# EasyEDA Pro project farmHot.eprj

# Schematic Schematic1
Board Name: Board1; Create Date: 2025-05-21; Page Name: P1; Project Name: farmHot; Schematic Name: Schematic1; Update Date: 2025-05-24; Company: EasyEDA.com; Page Size: A4; Version: V1.0
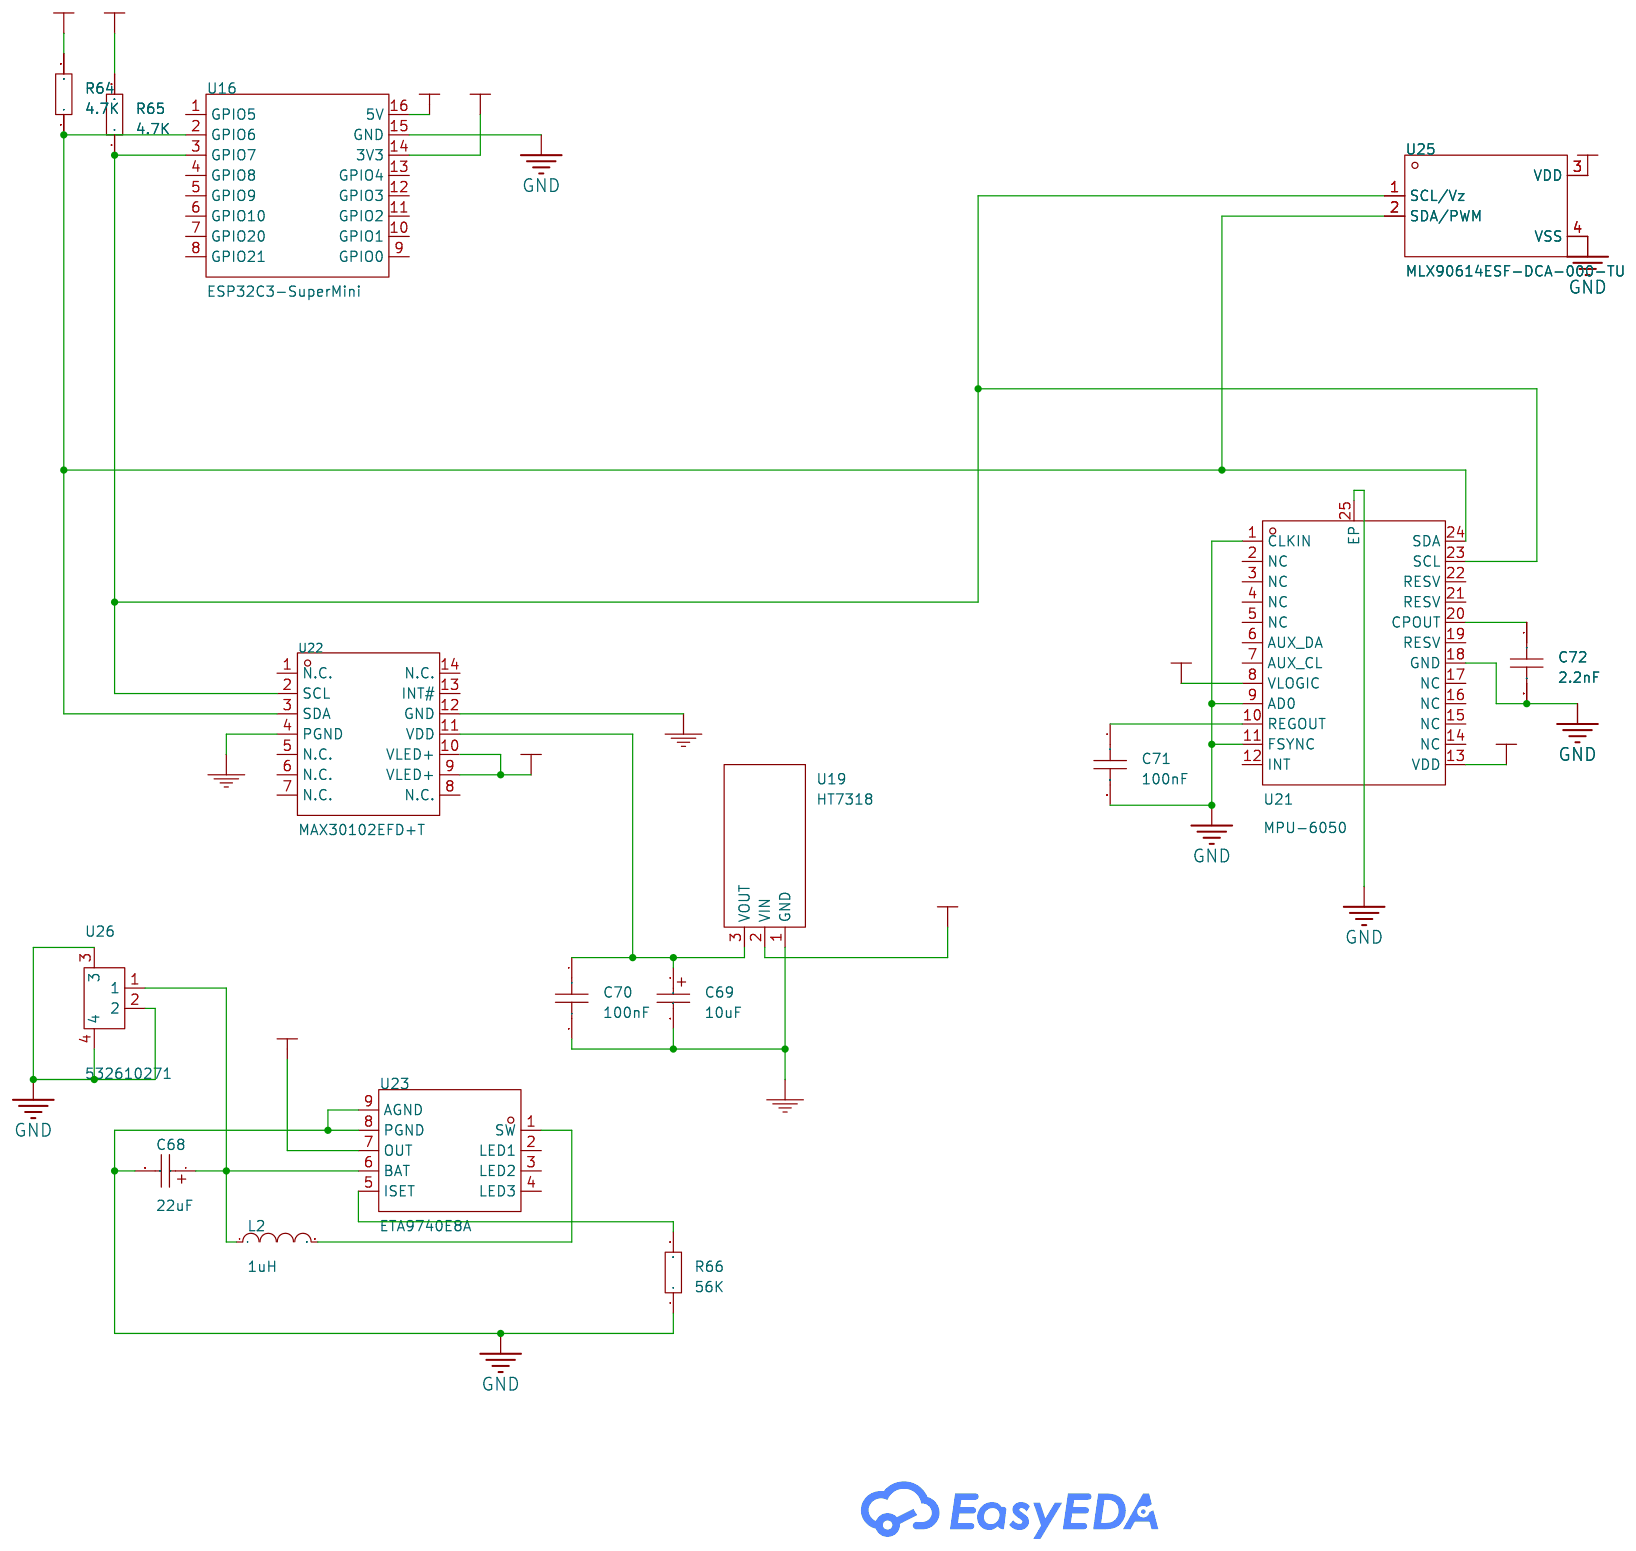
[diagram p0: schematic sheet]

## Parts
C68  22uF  [CAP-SMD_BD3.0-L3.3-W3.3-RD]
C69  10uF  [CAP-SMD_BD3.0-L3.3-W3.3-RD]
C70  100nF  [C0201]
C71  100nF  [C0201]
C72  2.2nF  [C0201]
L2  1uH  [L0402]
R64  4.7K  [R0603]
R65  4.7K  [R0603]
R66  56K  [R0603]
U16  ESP32C3-SuperMini  [COMM-SMD_16P-L22.5-W18.0-P2.54-TL]
U19  HT7318  [SOT-89-3_L4.5-W2.5-P1.50-LS4.2-BR]
U21  MPU-6050  [QFN-24_L4.0-W4.0-P0.50-BL-EP2.7]
U22  MAX30102EFD+T  [OESIP-14_L5.6-W3.3-P0.80-TL]
U23  ETA9740E8A  [ESOP-8_L4.9-W3.9-P1.27-LS6.0-BL-EP-1]
U25  MLX90614ESF-DCA-000-TU  [TO-39-4_MELEXIS_MLX90614XXA]
U26  532610271  [CONN-SMD_532610271]

## Library data of the parts
C68 C69 = C_Ele_SMD_3x5.4mm: Supplier Footprint: SMD,3x5.4mm
C70-C72 = CAP_0201: Supplier Footprint: 0201
L2 = L_0402
R64-R66 = Res_0603: Supplier Footprint: 0603
U16 = ESP32C3-SuperMini: Supplier Part: C9900147397; Supplier Footprint: SMD-16P; JLCPCB Part Class: Extended Part; Supplier: LCSC
U19 = HT7318_C259237: LCSC Part Name: 输入12V 输出1.8V 150mA; Supplier Part: C259237; Manufacturer: HOLTEK(合泰/盛群); Supplier Footprint: SOT-89-3; JLCPCB Part Class: Extended Part; Datasheet: https://atta.szlcsc.com/upload/public/pdf/source/20240403/B940B90F51FA39A5522B6E5C60F9C76D.pdf; Supplier: LCSC; Output Type: Fixed; Voltage - Supply: 12V; Output Voltage: 1.8V; Output Current: 150mA; Voltage Dropout: 170mV@(40mA); Output Configuration: Positive electrode; Number of Outputs: 1
U21 = MPU-6050: Supplier Part: C24112; Manufacturer: TDK InvenSense(应美盛); Supplier Footprint: QFN-24-EP(4x4); JLCPCB Part Class: Extended Part; Datasheet: https://atta.szlcsc.com/upload/public/pdf/source/20140425/1457707046159.pdf; Supplier: LCSC; Sensor Type: 加速度计陀螺仪; Operating Temperature: -40℃~+85℃
U22 = MAX30102EFD+T_C6454833: Supplier Part: C6454833; Manufacturer: ADI(亚德诺)/MAXIM(美信); Supplier Footprint: OESIP-14; JLCPCB Part Class: Extended Part; Datasheet: https://atta.szlcsc.com/upload/public/pdf/source/20230523/5357A0E2EBB238F1082B332F3131EA1A.pdf; Supplier: LCSC; Operating Temperature: -40℃~+85℃
U23 = ETA9740E8A: Supplier Part: C7465512; Manufacturer: ETA(钰泰); Supplier Footprint: ESOP8; JLCPCB Part Class: Extended Part; Datasheet: https://atta.szlcsc.com/upload/public/pdf/source/20230717/431179BC63C0A80883F19948963E29F3.pdf; Supplier: LCSC; Voltage - Supply: 4.5V~5.5V; Charging Saturation Voltage: 4.21V; End-Off Voltage: 3.2V; Type of Battery: Lithium-ion; Number of Cells: 1; Operating Temperature: -40℃~+85℃
U25 = MLX90614ESF-DCA-000-TU: Supplier Part: C17266420; Manufacturer: Melexis(比利时迈来芯); Supplier Footprint: TO-39; JLCPCB Part Class: Extended Part; Datasheet: https://atta.szlcsc.com/upload/public/pdf/source/231023/C17192539-0c521c61c9b67c34f193697436f9a827.pdf; Supplier: LCSC; Voltage - Supply: 2.6V~3.6V
U26 = 532610271_C177225: LCSC Part Name: 1x2P 间距:1.25mm 卧贴 系列:PicoBlade(MX 1.25); Supplier Part: C177225; Manufacturer: MOLEX; Supplier Footprint: SMD,P=1.25mm; JLCPCB Part Class: Extended Part; Supplier: LCSC; Pins Structure: 1x2P; Pitch: 1.25mm; Mounting Style: Horizontal attachment; Reference Series: PicoBlade(MX 1.25); Number of Pins: 2P; Number of Rows: 1; Number of PINs Per Row: 2; Current Rating (Max): 1A; Contact Material: Phosphor Bronze; Contact Plating: Tin; Operating Temperature Range: -40℃~+105℃; Rated Voltage (Max): 125V; Plastic Material: 玻纤增强PA; Flame Retardant Rating: UL94V-0; Supplementary Features: Auxiliary soldering legs; Colour: White; Z-Height of the Board: 3.4mm; X-Length of Bottom Edge on Board (Spacing Line): 7.65mm; Y-Width of Bottom Edge on Board: 5.2mm

## Nets
1.8V: C69.1 C70.1 U19.3(VOUT) U22.11(VDD)
3V3: R64.2 R65.2 U16.14(3V3) U19.2(VIN) U21.8(VLOGIC) U21.13(VDD) U22.9(VLED+) U22.10(VLED+) U25.3(VDD)
5V: U16.16(5V) U23.7(OUT)
GND: C68.2 C69.2 C70.2 C71.2 C72.2 R66.1 U16.15(GND) U19.1(GND) U21.1(CLKIN) U21.9(AD0) U21.11(FSYNC) U21.18(GND) U21.25(EP) U22.4(PGND) U22.12(GND) U23.8(PGND) U23.9(AGND) U25.4(VSS) U26.2 U26.3 U26.4
$1N754: R65.1 U16.3(GPIO7) U21.23(SCL) U22.2(SCL) U25.1(SCL/Vz)
$1N755: R64.1 U16.2(GPIO6) U21.24(SDA) U22.3(SDA) U25.2(SDA/PWM)
$1N7337: C68.1 L2.1 U23.6(BAT) U26.1
$1N11704: R66.2 U23.5(ISET)
$1N11786: L2.2 U23.1(SW)
$1N12199: C71.1 U21.10(REGOUT)
$1N12305: C72.1 U21.20(CPOUT)

Not connected (* = marked no-connect by the designer): U16 1(GPIO5) 4(GPIO8) 5(GPIO9) 6(GPIO10) 7(GPIO20) 8(GPIO21) 9(GPIO0) 10(GPIO1) 11(GPIO2) 12(GPIO3) 13(GPIO4); U21 2(NC) 3(NC) 4(NC) 5(NC) 6(AUX_DA) 7(AUX_CL) 12(INT) 14(NC) 15(NC) 16(NC) 17(NC) 19(RESV) 21(RESV) 22(RESV); U22 1(N.C.) 5(N.C.) 6(N.C.) 7(N.C.) 8(N.C.) 13(INT#) 14(N.C.); U23 2(LED1) 3(LED2) 4(LED3)

# Schematic Lipo Rider Plus
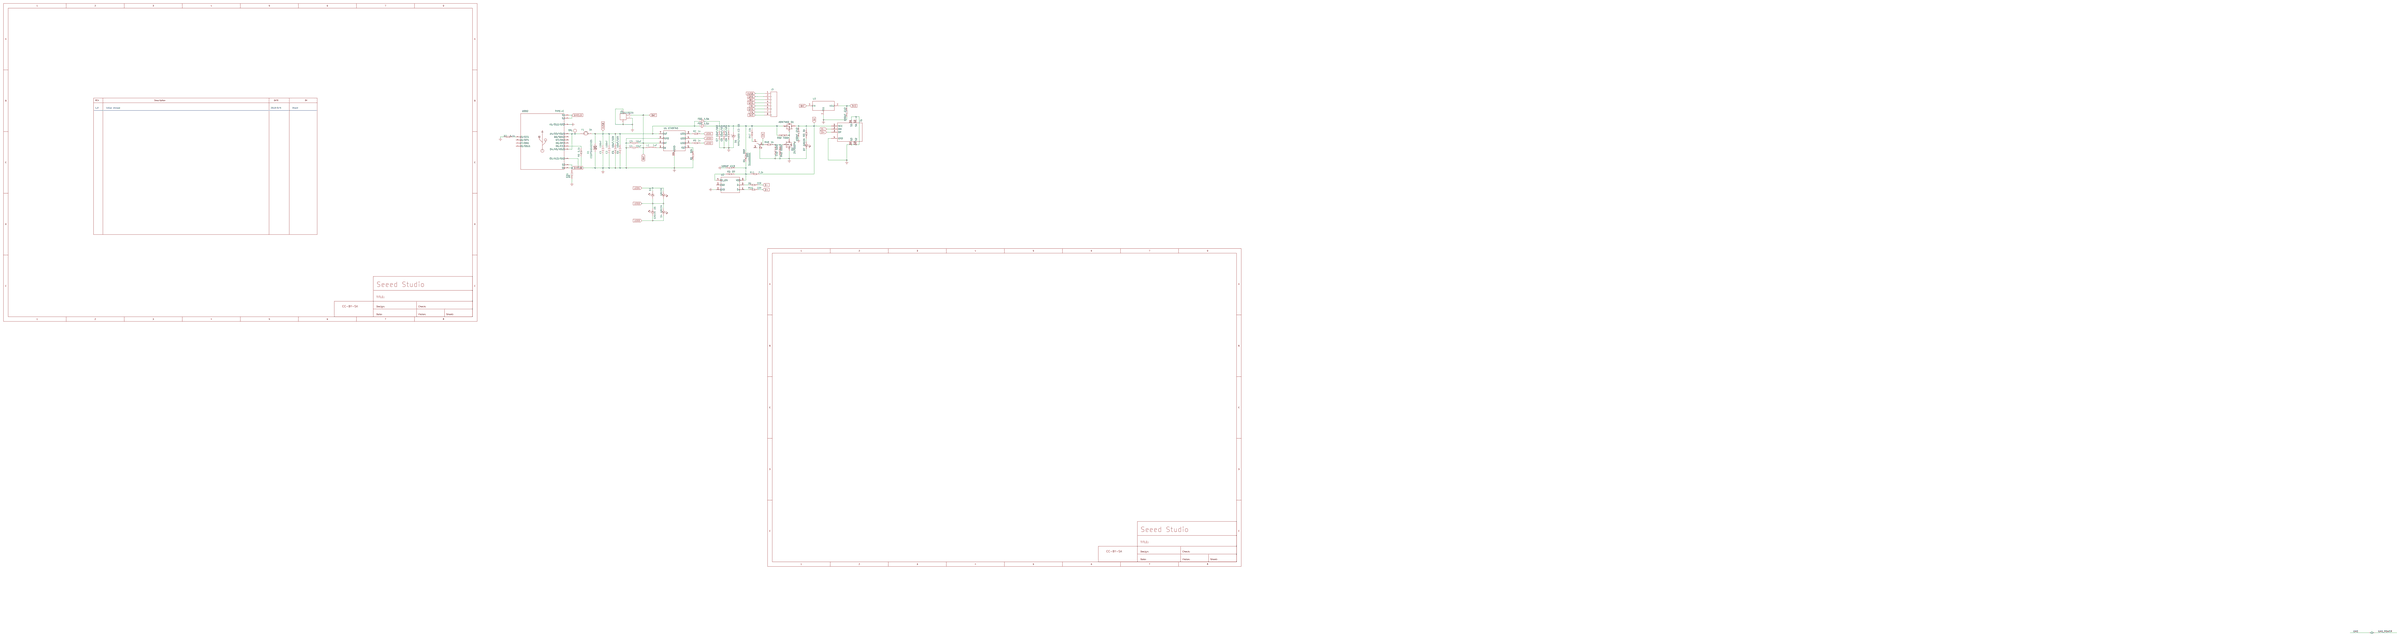
[diagram p1: schematic sheet]

## Parts
C1  100nF
C2  100nF
C3  10uF
C4  10uF
C5  10uF/10V
C6  10uF/10V
C7  10uF/10V
C8  10uF/10V
C9  10uF/10V
C11  0R
C12  100nF
C13  100nF
C42  10nF
C43  100nF
D1  ESDPSA0402V05
D2  GREEN
D3  GREEN
D4  GREEN
D5  GREEN
D6  MMSZ4689-E3-08
D7  GREEN
F1  3A
FB1  1.5A
FB2  1.5A
FR1  SEEEDSTUDIO-OPEN-SCH-FRAME-BIG
FR2  SEEEDSTUDIO-OPEN-SCH-FRAME-BIG
J2  USB4+4P-SMD+DIP
J3  HEADER-8P-65/35MIL
J4  320110026
L1  1uF
Q1  AON7403
Q2  2N7002PW
R1  56k
R2  1k
R3  1k
R4  DNP
R5  0R
R6  22R
R7  5.1k
R8  5.1k
R9  1k
R10  22R
R11  2.2k
R32  100k
R46  100k
R47  10k
R48  1k
SW1  311030001
TP1  TEST
U1  ETA9740
U2  CONTROLLER-FP6601Q
U3  PMIC-XC6206PMR
U$3  SEEDSTUDIO-SCH-MODLIST
USB2  TYPE-C

## Library data of the parts
C1 C2 C11-C13 C42 C43 = Discrete-new_CAP_-0402
C3 C4 = Discrete-new_CAP_-0603
C5-C9 = Discrete-new_CAP_-0805
D1 = Discrete-new_D-ESD-2P-DOUBLE_-0402
D2-D5 D7 = Discrete-new_LED_-0402
D6 = Discrete-new_D-ZENER-2P_-304030008
F1 = Discrete-new_FUSE_'1812'
FB1 FB2 = Discrete-new_FERRITE-BEAD_-0805
FR1 FR2 = moudle-new_SEEEDSTUDIO-OPEN-SCH-FRAME-BIG_: DRAWING_NAME: Lipo Rider Plus; SHEET: 1/1
J2 = Connector-new_USB4+4P_-SMD+DIP
J3 = Connector-new_HEADER-8P_-65/35MIL
J4 = Connector-new_JST-2P-SMD_'2.0'
L1 = Discrete-new_INDUCTOR_-4430
Q1 = Discrete-new_MOSFET-P_-AON7403
Q2 = Discrete-new_MOSFET-N_'SI1304BDL'
R1-R11 R32 R46-R48 = Discrete-new_RES_-0402
SW1 = Discrete-new_SWITCH-3+4P_-311030001
TP1 = Discrete-new_TEST-POINT_'4545'
U1 = IC-new_PMIC-ETA9740_
U2 = IC-new_CONTROLLER-FP6601Q_
U3 = IC-new_PMIC-XC6206P_MR
U$3 = moudle-new_SEEDSTUDIO-SCH-MODLIST_
USB2 = Connector-new_USB2.0-TYPE-C_

## Nets
3V3: C12.1 J3.8 U3.2(VOUT)
5V: C43.1 J2.1(VCC) J3.5 Q1.5*5(D) R3.2 R11.2
GND_POWER: C1.2 C2.2 C3.2 C4.2 C5.1 C6.1 C7.1 C8.1 C9.1 C11.2 C12.2 C13.2 C42.2 C43.2 D1.1 D6.+ D7.- J2.4(GND) J2.S1(S0) J2.S2(S1) J2.S3(S2) J2.S4(S3) J3.2 J3.4 J3.6 J4.3 J4.4 J4.-(2) Q2.2(S) R1.1 R7.1 R8.2 R46.1 SW1.SS1*4(SS2) U1.8(PGND) U1.PAD(AGND) U2.2(GND) U3.1(VSS) USB2.A1_B12(A1/B12/GND) USB2.B1_A12(B1/A12/GND)
VCC_5V: C7.2 C8.2 C9.2 D6.- FB1.2 FB2.2 Q1.1*3(S) R4.2 R32.1 R47.2
BAT: C3.1 C4.1 J3.3 J4.+(1) L1.1 U1.6(BAT) U3.3(VIN)
D+: J2.3(DP) R10.2
D-: J2.2(DM) R6.2
EN: J3.7 R48.1 SW1.2(COM)
LED1: D2.+ D3.- R2.2
LED2: D4.- D5.+ R9.2
LED3: D2.- D3.+ D4.+ D5.- U1.4(LED3)
N$1: R7.2 USB2.A5(A5/CC1)
N$2: R8.1 USB2.B5(B5/CC2)
N$3: R47.1 SW1.1(A)
N$4: F1.1 TP1.T USB2.A4_B9(A4/B9/VBUS) USB2.B4_A9(B4/A9/VBUS)
N$6: D7.+ R3.1
N$7: R1.2 U1.5(ISET)
N$8: L1.2 U1.1(SW)
N$9: R9.1 U1.3(LED2)
N$10: R5.1 U2.4(QC_EN)
N$11: C13.1 R4.1 R5.2 R11.1 U2.5(VDD)
N$12: R2.1 U1.2(LED1)
N$13: R6.1 U2.6(D-)
N$14: R10.1 U2.1(D+)
N$49: Q1.4(G) Q2.3(D) R32.2
N$52: C42.1 Q2.1(G) R46.2 R48.2
SHIELD: C11.1 USB2.S1*2(S1) USB2.S2*2(S2) USB2.S3 USB2.S4
VUSB: C1.1 C2.1 C5.2 C6.2 D1.2 F1.2 FB1.1 FB2.1 J3.1 U1.7(OUT)

Not connected (* = marked no-connect by the designer): SW1 3(B); U2 3(FBO); USB2 A6(A6/DP1) A7(A7/DN1) A8(A8/SBU1) B6(B6/DP2) B7(B7/DN2) B8(B8/SBU2)

## Notes on the sheet
- 1.0
- initial release
- 2019/9/6
- Bruce

# Schematic Adafruit MPU6050
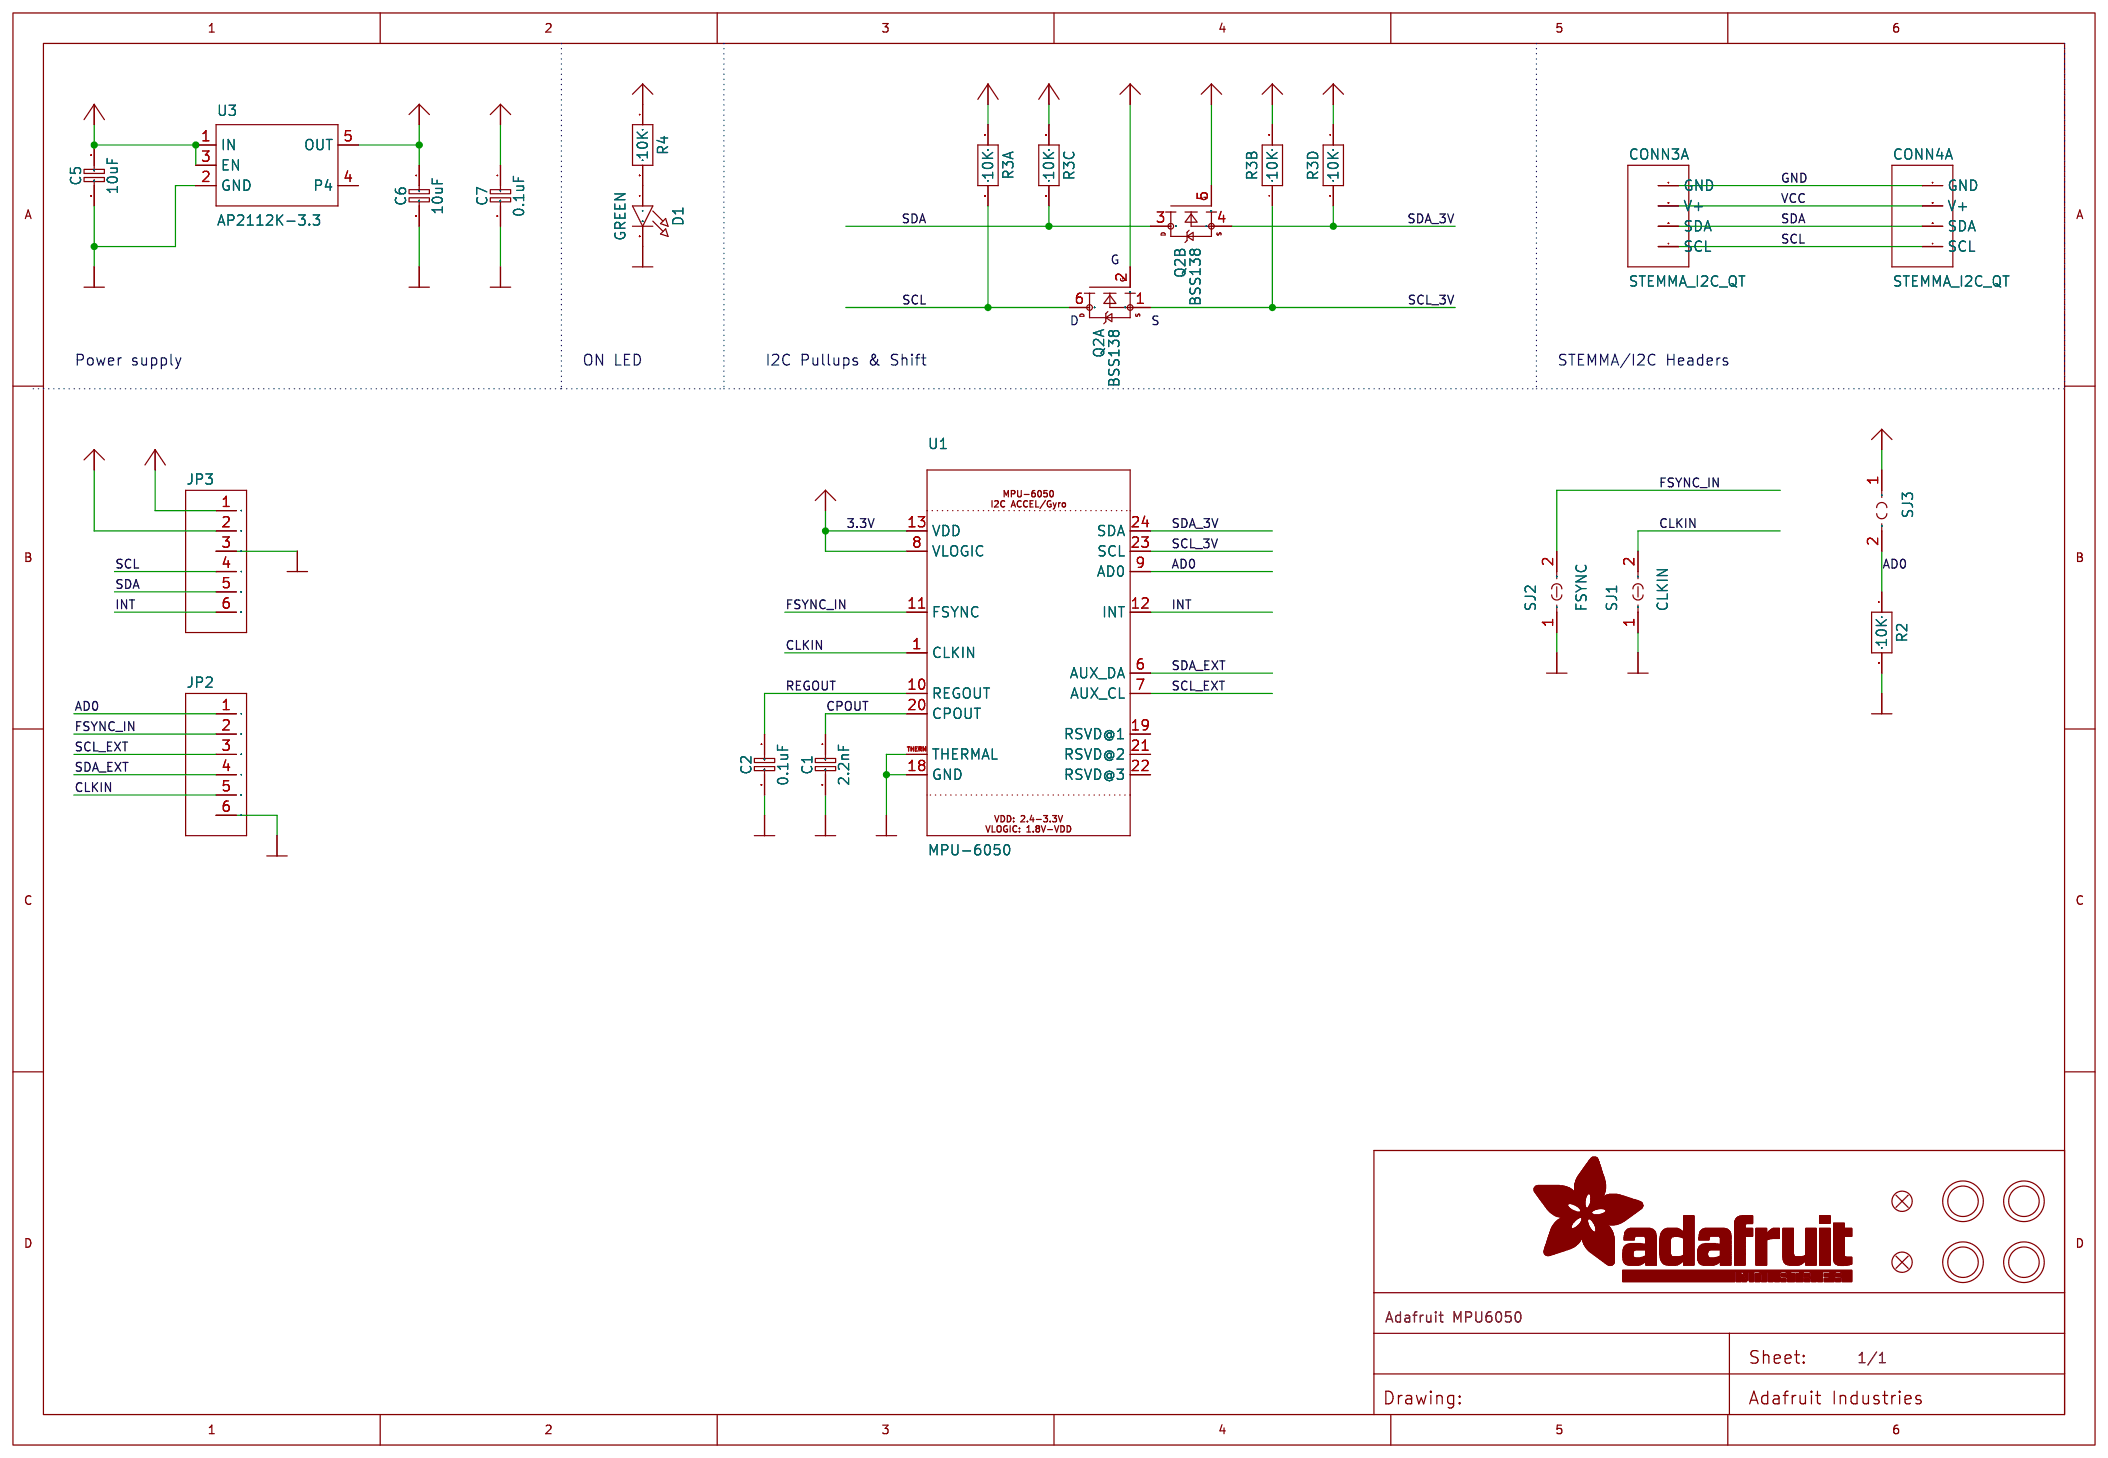
[diagram p2: schematic sheet]

## Parts
C1  2.2nF
C2  0.1uF
C5  10uF
C6  10uF
C7  0.1uF
CONN3  STEMMA_I2C_QT  (section G$1)
CONN4  STEMMA_I2C_QT  (section G$1)
D1  GREEN
FID3  FIDUCIAL_1MM
FID4  FIDUCIAL_1MM
JP2  HEADER-1X6ROUND
JP3  HEADER-1X670MIL
Q2  BSS138  (sections G$1,G$2)
R2  10K
R3  10K  (sections G$1,G$2,G$3,G$4)
R4  10K
SJ1  CLKIN
SJ2  FSYNC
SJ3  SOLDERJUMPER
U1  MPU-6050
U3  AP2112K-3.3
U$39  MOUNTINGHOLE2.5
U$40  MOUNTINGHOLE2.5
U$41  FRAME_A4_ADAFRUIT
U$42  MOUNTINGHOLE2.5
U$43  MOUNTINGHOLE2.5

## Library data of the parts
C1 C2 C7 = microbuilder_CAP_CERAMIC_0603_NO
C5 C6 = microbuilder_CAP_CERAMIC_0805-NOOUTLINE
CONN3 CONN4 = microbuilder_STEMMA_I2C__QT
D1 = microbuilder_LED_0603_NOOUTLINE
FID3 FID4 = microbuilder_FIDUCIAL__1MM
JP2 = microbuilder_HEADER-1X6_ROUND
JP3 = microbuilder_HEADER-1X6_70MIL
Q2 = microbuilder_MOSFET-N_DUAL_
R2 R4 = microbuilder_RESISTOR__0603_NOOUT
R3 = microbuilder_RESISTOR_4PACK_
SJ1 SJ2 = microbuilder_SOLDERJUMPER_CLOSED_
SJ3 = microbuilder_SOLDERJUMPER_
U1 = microbuilder_MPU-6050_
U3 = microbuilder_VREG_SOT23-5_
U$39 U$40 U$42 U$43 = microbuilder_MOUNTINGHOLE_2.5
U$41 = microbuilder_FRAME_A4_ADAFRUIT_: DRAWING_NAME: Adafruit MPU6050; SHEET: 1/1

## Nets
3.3V: C6.1 C7.1 JP3.2 Q2.2(G) Q2.5(G) R3.2(1) R3.4(1) R4.1 SJ3.1 U1.8(VLOGIC) U1.13(VDD) U3.5(OUT)
GND: C1.2 C2.2 C5.2 C6.2 C7.2 CONN3.1(GND) CONN4.1(GND) D1.C JP2.6 JP3.3 R2.2 SJ1.1 SJ2.1 U1.18(GND) U1.THERM(THERMAL) U3.2(GND)
VCC: C5.1 CONN3.2(V+) CONN4.2(V+) JP3.1 R3.1 R3.3(1) U3.1(IN) U3.3(EN)
AD0: JP2.1 R2.1 SJ3.2 U1.9(AD0)
CLKIN: JP2.5 SJ1.2 U1.1(CLKIN)
CPOUT: C1.1 U1.20(CPOUT)
FSYNC_IN: JP2.2 SJ2.2 U1.11(FSYNC)
INT: JP3.6 U1.12(INT)
N$1: D1.A R4.2
REGOUT: C2.1 U1.10(REGOUT)
SCL: CONN3.4(SCL) CONN4.4(SCL) JP3.4 Q2.6(D) R3.8(2)
SCL_3V: Q2.1(S) R3.7(2) U1.23(SCL)
SCL_EXT: JP2.3 U1.7(AUX_CL)
SDA: CONN3.3(SDA) CONN4.3(SDA) JP3.5 Q2.3(D) R3.6(2)
SDA_3V: Q2.4(S) R3.5(2) U1.24(SDA)
SDA_EXT: JP2.4 U1.6(AUX_DA)

Not connected (* = marked no-connect by the designer): U1 19(RSVD@1) 21(RSVD@2) 22(RSVD@3); U3 4(P4)

## Notes on the sheet
- G
- D
- S
- Power supply
- ON LED
- I2C Pullups & Shift
- STEMMA/I2C Headers

# Schematic GY-906 MLX90614
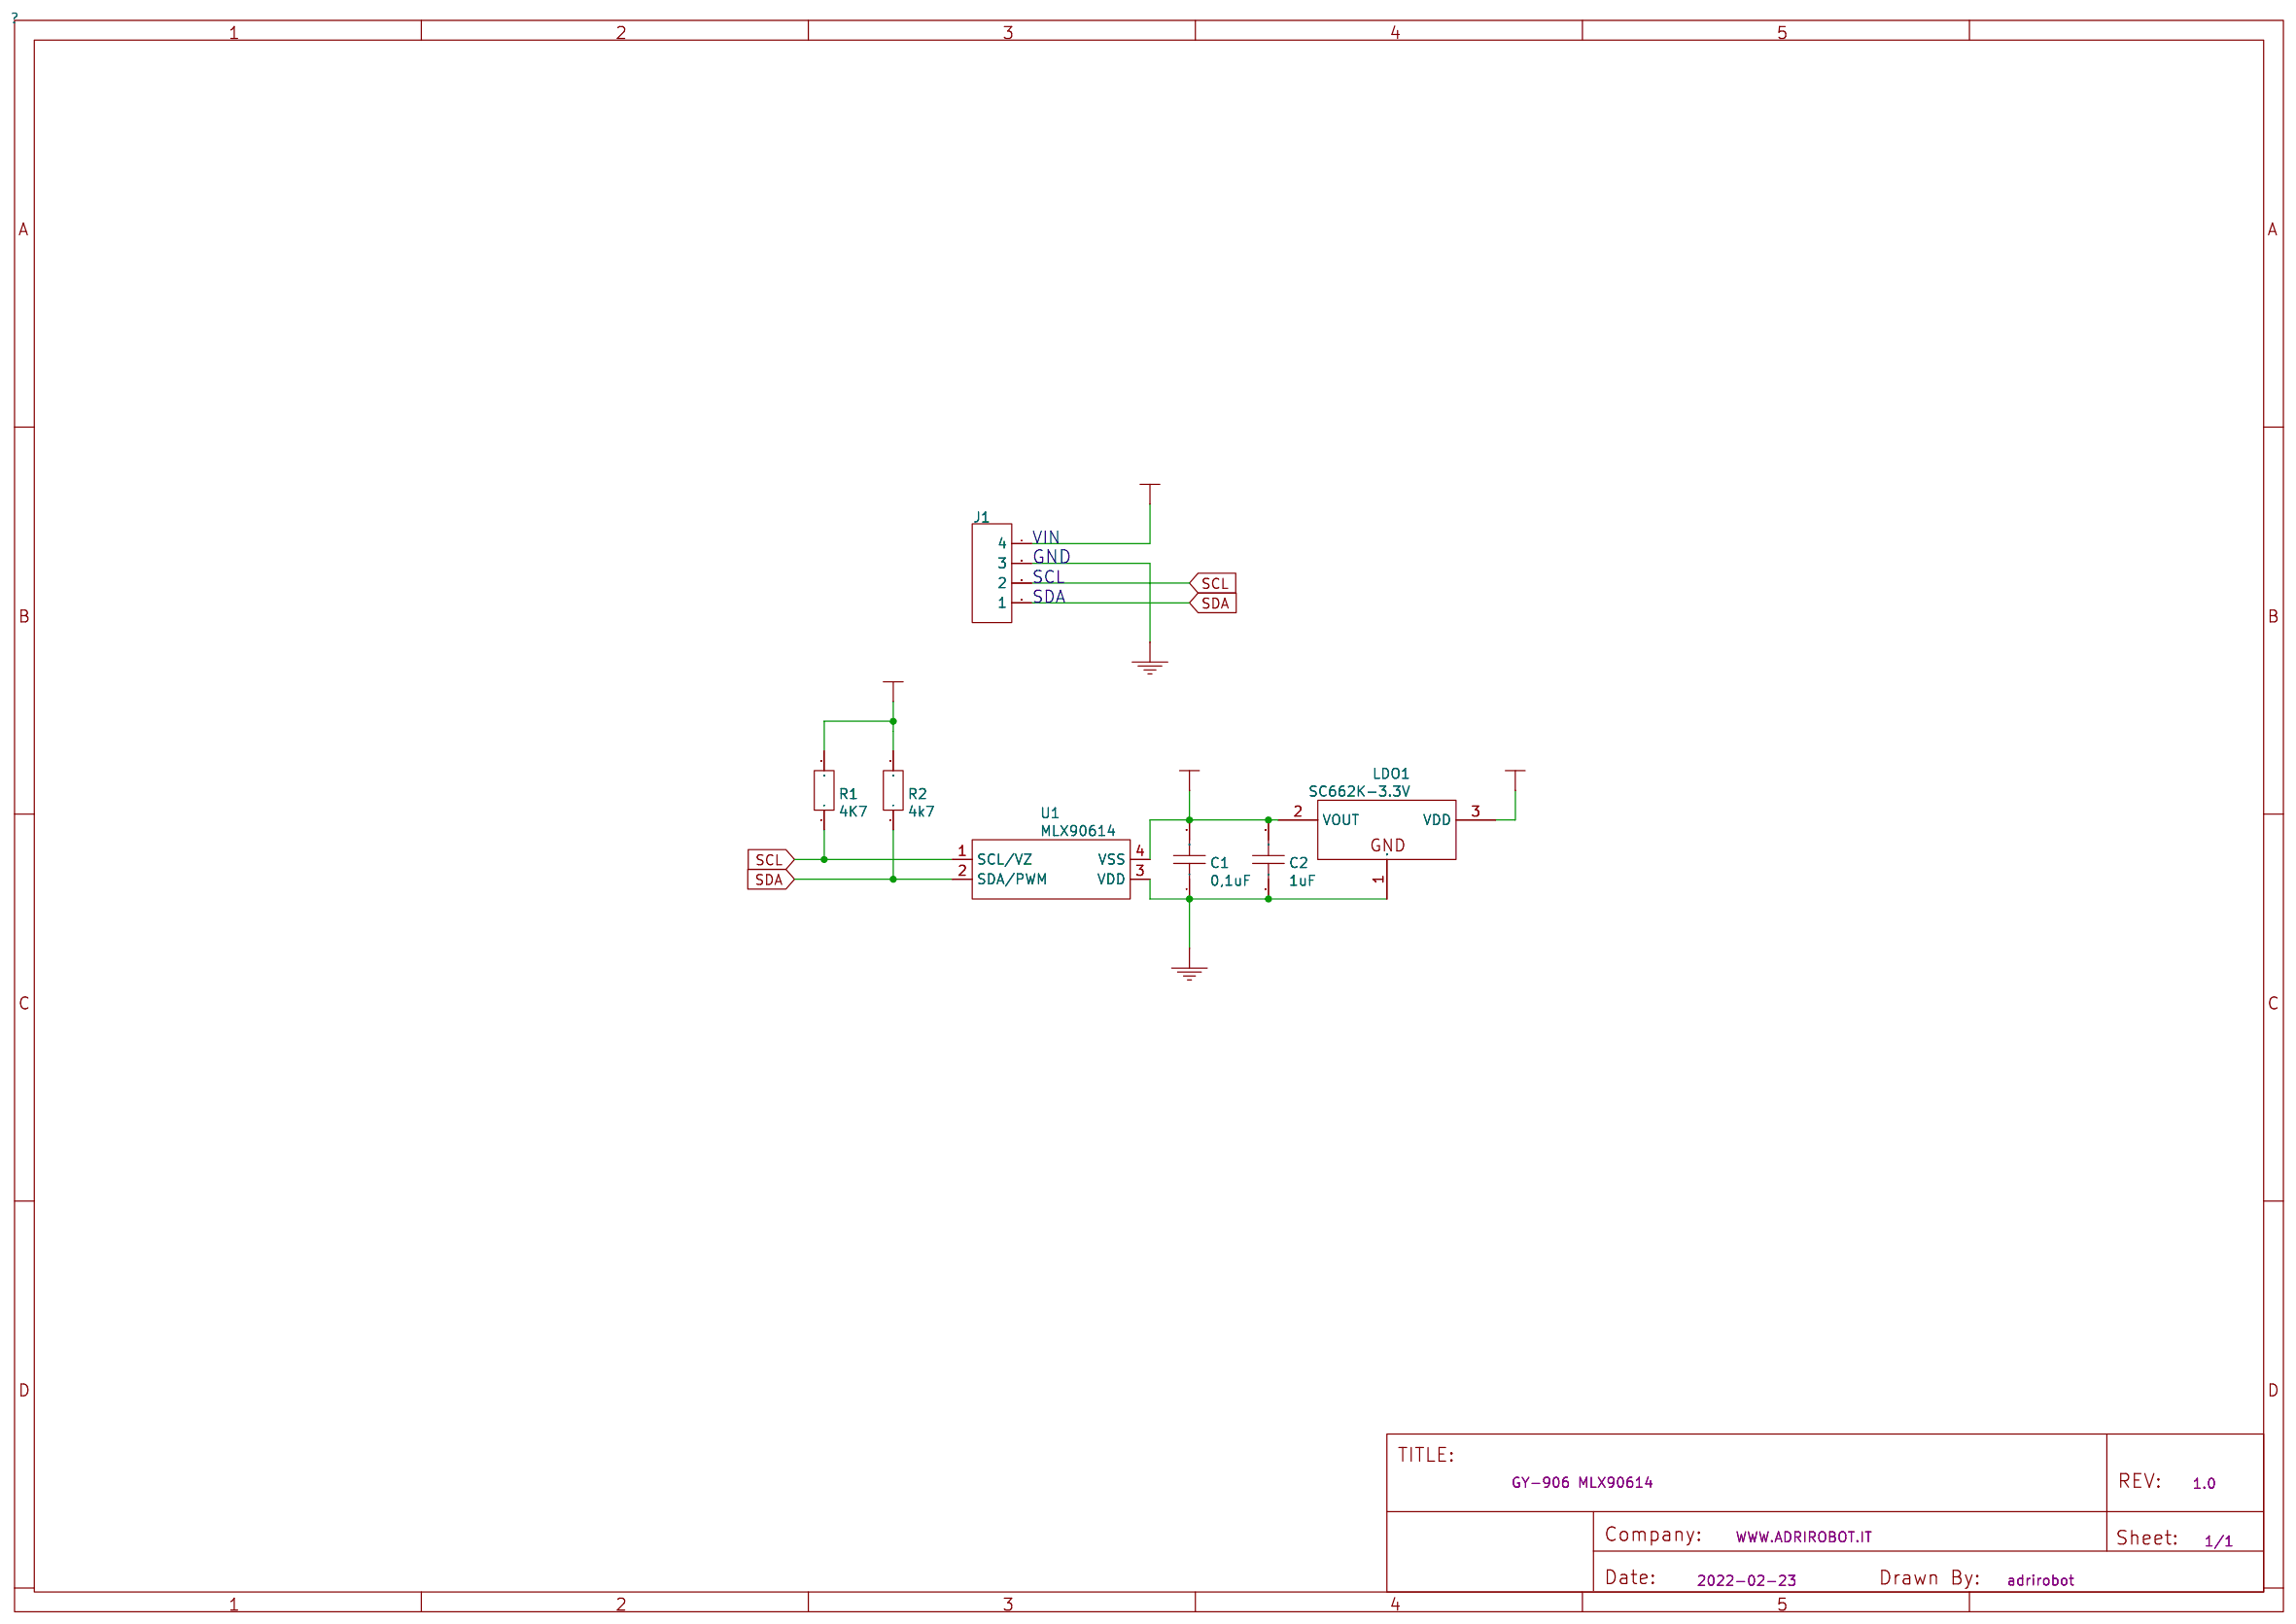
[diagram p3: schematic sheet]

## Parts
C1  0,1uF
C2  1uF
J1  HDR-M-2.54_1x4
LDO1  SC662K-3.3V
R1  4K7
R2  4k7
U1  MLX90614

## Library data of the parts
C1 = 0,1uF: nameAlias: Value(F); Contributor: LCEDA_Lib; spicePre: C; spiceSymbolName: C_0603_US
C2 = 1uF: nameAlias: Value(F); Contributor: LCEDA_Lib; spicePre: C; spiceSymbolName: C_0603_US
J1 = HDR-M-2.54_1x4: Supplier Part: C124378; Supplier: LCSC; Contributor: LCEDA_Lib; spicePre: J
LDO1 = SC662K-3.3V: Supplier: LCSC; Manufacturer: FM; Supplier Part: C83932; JLCPCB Part Class: Extended Part; spicePre: L
R1 = 4K7: nameAlias: Value(Ω); Contributor: LCEDA_Lib; spicePre: R; spiceSymbolName: R_0603_EU
R2 = 4k7: nameAlias: Value(Ω); Contributor: LCEDA_Lib; spicePre: R; spiceSymbolName: R_0603_EU
U1 = MLX90614: Supplier: LCSC; Supplier Part: C2837265; Manufacturer: null; JLCPCB Part Class: Extended Part; Contributor: LCSC; spicePre: U

## Nets
+3.3V: C1.2 C2.2 LDO1.2(VOUT) R1.2 R2.2 U1.4(VSS)
GND: C1.1 C2.1 J1.3 LDO1.1(GND) U1.3(VDD)
VIN: J1.4 LDO1.3(VDD)
SCL: J1.2 R1.1 U1.1(SCL/VZ)
SDA: J1.1 R2.1 U1.2(SDA/PWM)

## Notes on the sheet
- GND
- VIN
- SCL
- SDA

# Schematic SCH_max30102-schematic_2025-05-21
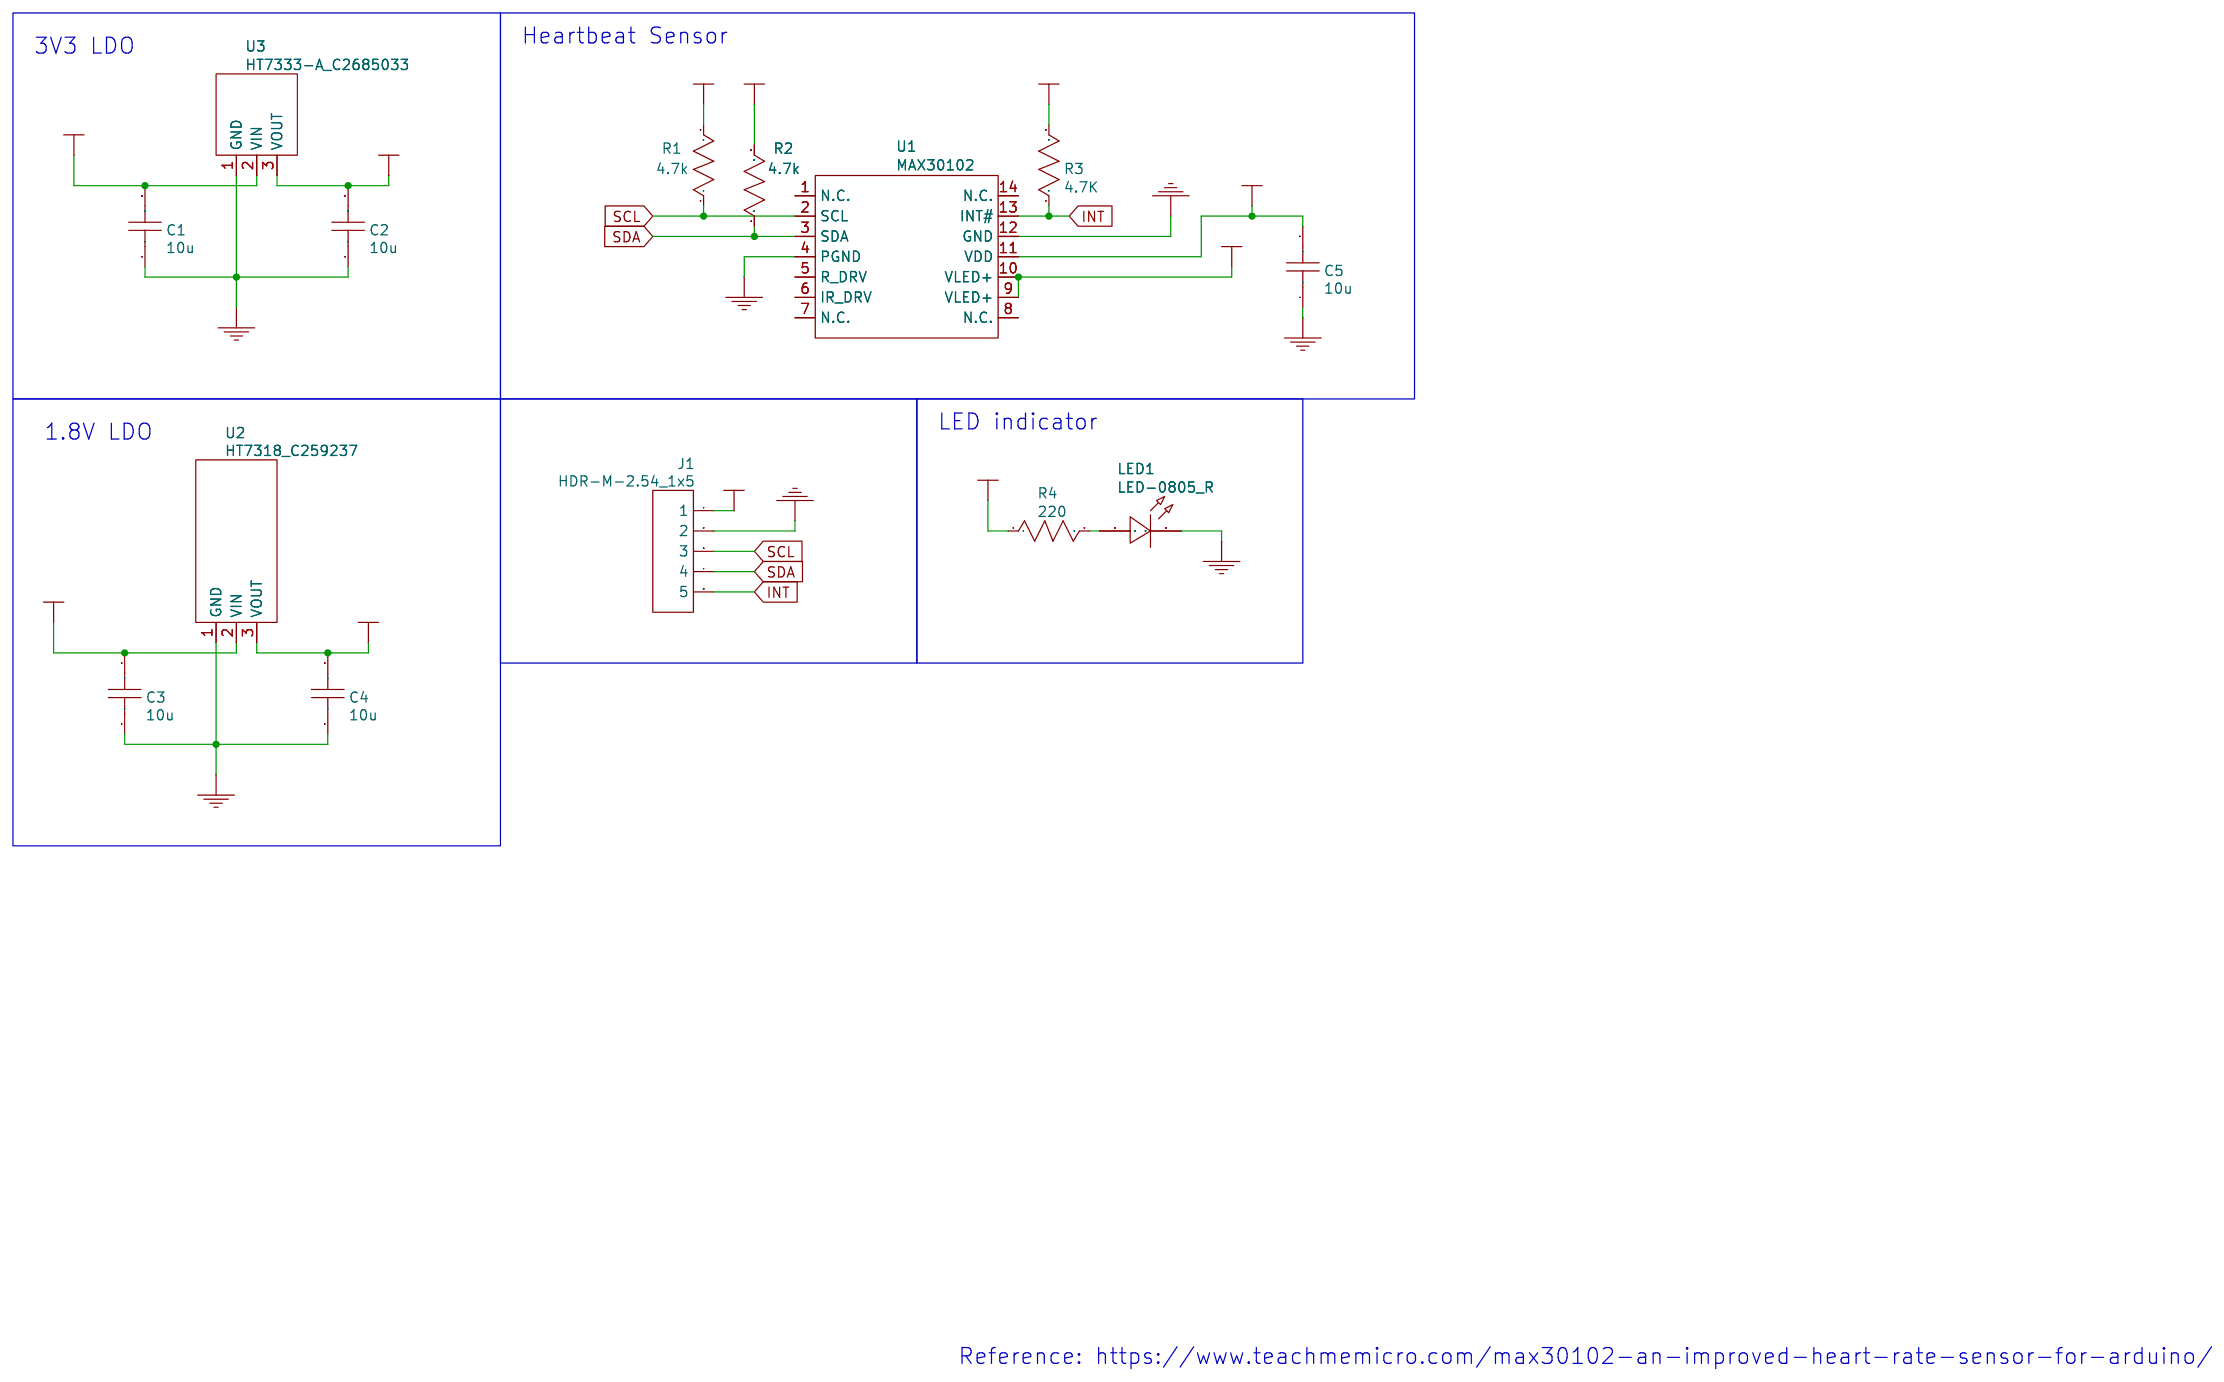
[diagram p4: schematic sheet]

## Parts
C1  10u
C2  10u
C3  10u
C4  10u
C5  10u
J1  HDR-M-2.54_1x5
LED1  LED-0805_R
R1  4.7k
R2  4.7k
R3  4.7K
R4  220
U1  MAX30102
U2  HT7318_C259237
U3  HT7333-A_C2685033

## Library data of the parts
C1-C5 = 10u: nameAlias: Value(F); Contributor: LCEDA_Lib; spicePre: C; spiceSymbolName: C_0402_US
J1 = HDR-M-2.54_1x5: Supplier Part: C358687; Supplier: LCSC; Contributor: LCEDA_Lib; spicePre: J
LED1 = LED-0805_R: Manufacturer: EVERLIGHT(台湾亿光); Manufacturer Part: 17-21SURC/S530-A3/TR8; Supplier Part: C72037; Contributor: LCEDA_Lib; spicePre: L
R1 R2 = 4.7k: nameAlias: Value(Ω); Contributor: LCEDA_Lib; spicePre: R; spiceSymbolName: R_0402_US
R3 = 4.7K: nameAlias: Value(Ω); Contributor: LCEDA_Lib; spicePre: R; spiceSymbolName: R_0402_US
R4 = 220: nameAlias: Value(Ω); Contributor: LCEDA_Lib; spicePre: R; spiceSymbolName: R_0402_US
U1 = MAX30102: Supplier: LCSC; Supplier Part: C2839431; Manufacturer: null; JLCPCB Part Class: Extended Part; Contributor: LCSC; spicePre: U
U2 = HT7318_C259237: Supplier: LCSC; Supplier Part: C259237; Manufacturer: Holtek Semicon; Manufacturer Part: HT7318; JLCPCB Part Class: Extended Part; Contributor: 立创EDA官方封装库; spicePre: U
U3 = HT7333-A_C2685033: Supplier: LCSC; Supplier Part: C2685033; Manufacturer: 国芯佳品; Manufacturer Part: HT7333-A; JLCPCB Part Class: Extended Part; Contributor: LCSC; spicePre: U

## Nets
1.8V: C4.2 C5.2 U1.11(VDD) U2.3(VOUT)
3V3: C2.2 R1.2 R2.2 R3.2 R4.1 U1.9(VLED+) U1.10(VLED+) U3.3(VOUT)
GND: C1.1 C2.1 C3.1 C4.1 C5.1 J1.2 LED1.2 U1.4(PGND) U1.12(GND) U2.1(GND) U3.1(GND)
VCC: C1.2 C3.2 J1.1 U2.2(VIN) U3.2(VIN)
INT: J1.5 R3.1 U1.13(INT#)
SCL: J1.3 R1.1 U1.2(SCL)
SDA: J1.4 R2.1 U1.3(SDA)
Net-(LED1-1): LED1.1 R4.2

Not connected (* = marked no-connect by the designer): U1 1(N.C.) 5(R_DRV) 6(IR_DRV) 7(N.C.) 8(N.C.) 14(N.C.)

## Notes on the sheet
- Heartbeat Sensor
- 3V3 LDO
- 1.8V LDO
- LED indicator
- Reference: https://www.teachmemicro.com/max30102-an-improved-heart-rate-sensor-for-arduino/

# Board PCB1
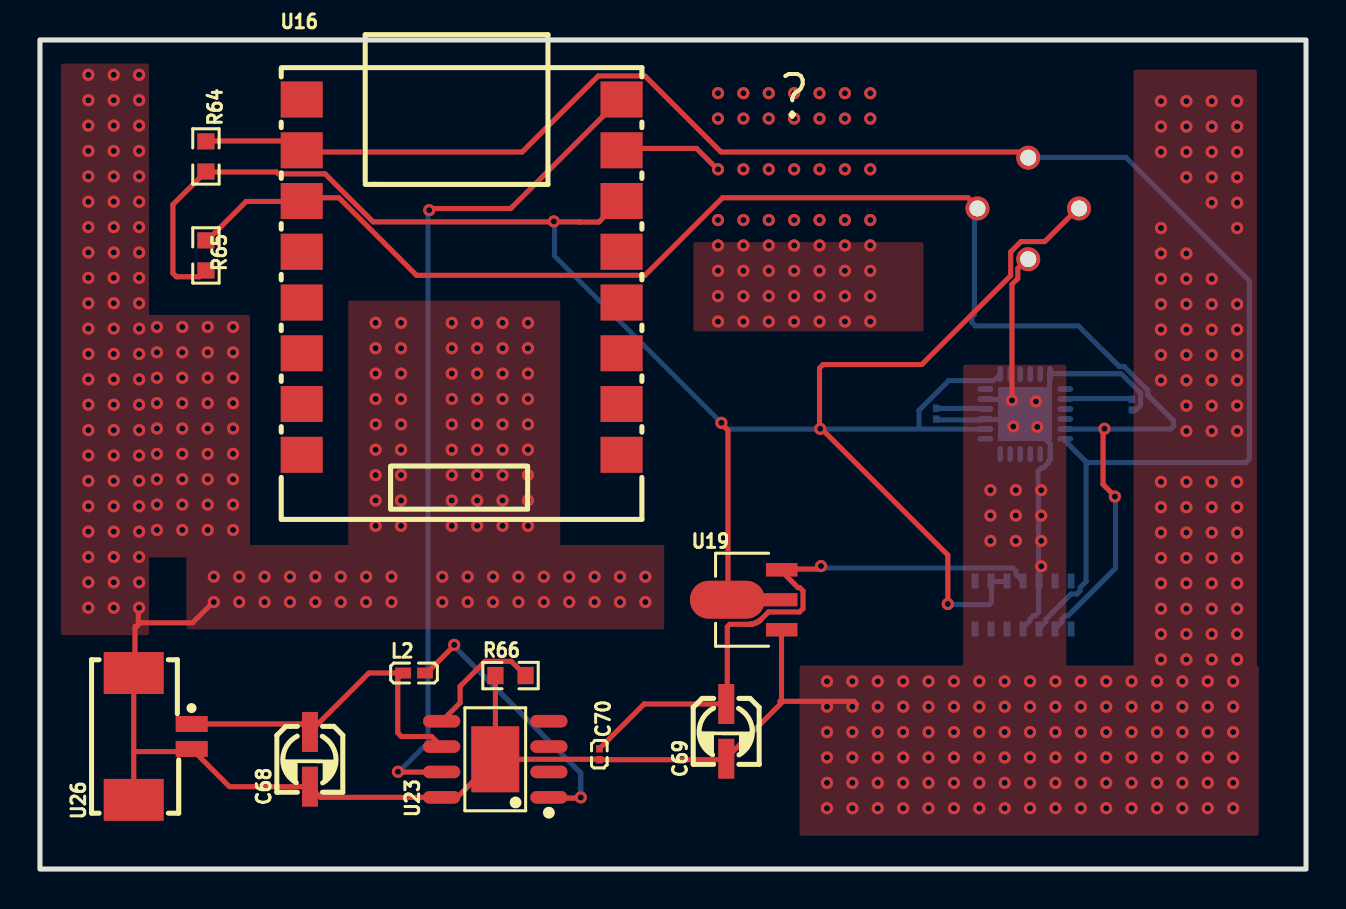
[diagram p5: board, top side]
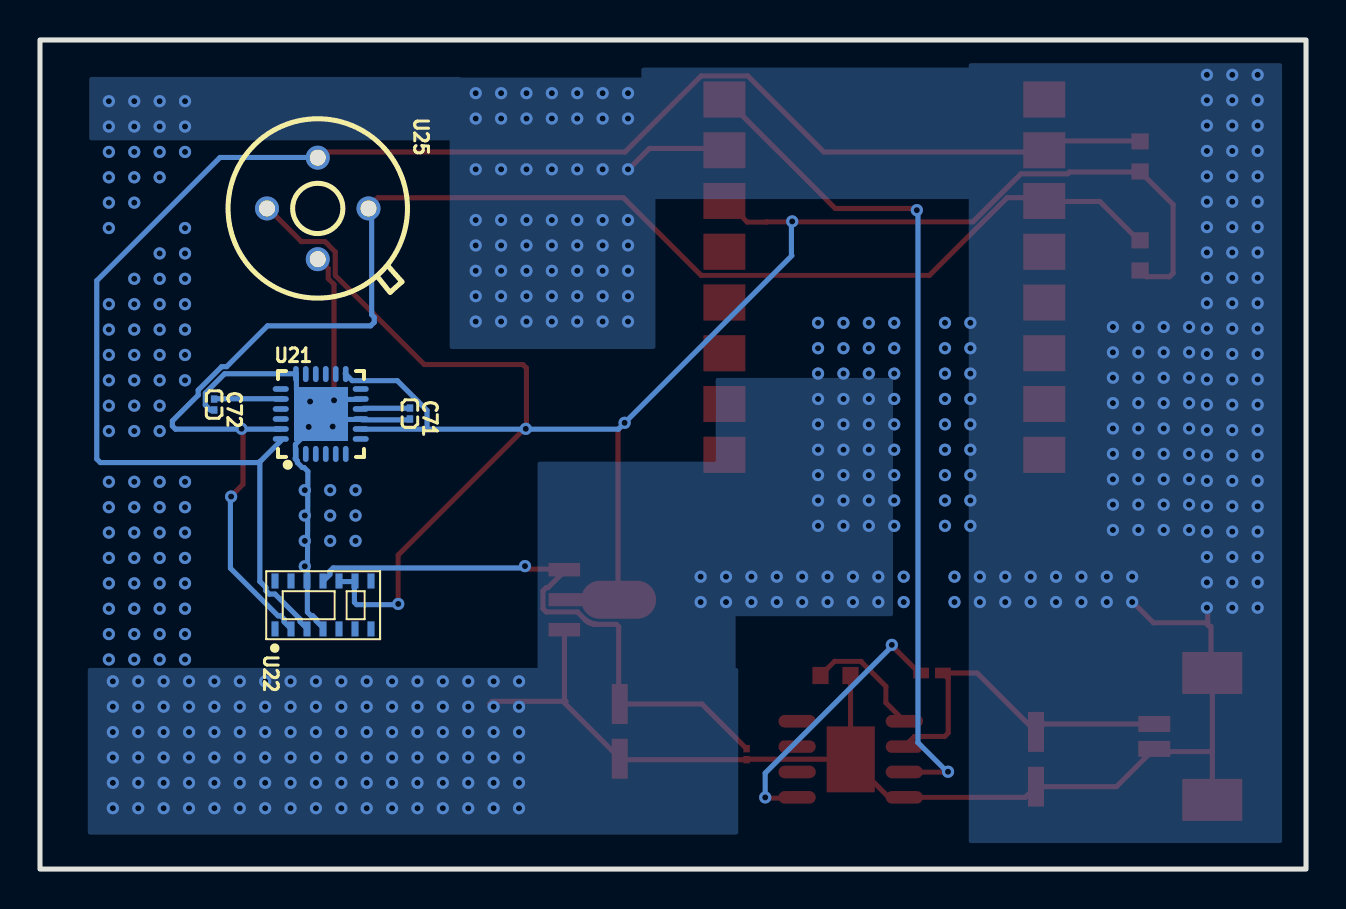
[diagram p6: board, bottom side, seen from below]

Outline 63.34 x 41.49 mm; copper layers: Top Layer, Bottom Layer. Coordinates in mm from the lower left corner of the outline.
Outline path: rectangle 0,41.49 63.34,0
Stack: Top Layer 0.035mm / Dielectric1 1.51mm FR4 er 4.5 / Bottom Layer 0.035mm

## Design rules (mm)
template: JLCPCB Capability(Two Layers Board)
spacing copperThickness1oz (default): track to track 0.102, other pairs 0.152 to 0.3
spacing copperThickness2oz: track to track 0.203, other pairs 0.152 to 0.3
track width copperThickness1oz (default): min 0.127, default 0.254, max 2.54
track width copperThickness2oz: min 0.203, default 0.254, max 2.54
differential pair differentialPair (default): width min 0.127, default 0.254, max 2.54; gap min 0.152, default 0.152
via viaSize (default): diameter min 0.5, default 0.61, max 10; hole min 0.3, default 0.305, max 6.3

## Placement (name value [footprint] x y rotation side)
C68  22uF  [CAP-SMD_BD3.0-L3.3-W3.3-RD]  13.51 5.49 90 top
C69  10uF  [CAP-SMD_BD3.0-L3.3-W3.3-RD]  34.34 6.89 90 top
C70  100nF  [C0201]  27.99 5.75 270 top
C71  100nF  [C0201]  44.83 22.8 270 bottom
C72  2.2nF  [C0201]  54.63 23.25 270 bottom
L2  1uH  [L0402]  18.71 9.81 0 top
R64  4.7K  [R0603]  8.3 35.66 270 top
R65  4.7K  [R0603]  8.3 30.71 270 top
R66  56K  [R0603]  23.54 9.68 0 top
U16  ESP32C3-SuperMini  [COMM-SMD_16P-L22.5-W18.0-P2.54-TL]  21.1 29.62 0 top
U19  HT7318  [SOT-89-3_L4.5-W2.5-P1.50-LS4.2-BR]  35.75 13.48 0 top
U21  MPU-6050  [QFN-24_L4.0-W4.0-P0.50-BL-EP2.7]  49.29 22.77 180 bottom
U22  MAX30102EFD+T  [OESIP-14_L5.6-W3.3-P0.80-TL]  49.18 13.22 90 bottom
U23  ETA9740E8A  [ESOP-8_L4.9-W3.9-P1.27-LS6.0-BL-EP-1]  22.78 5.49 90 top
U25  MLX90614ESF-DCA-000-TU  [TO-39-4_MELEXIS_MLX90614XXA]  49.44 33.06 270 bottom
U26  532610271  [CONN-SMD_532610271]  6.14 6.64 90 top

## Footprints (pads in the part's own frame, mm; a bottom-side part is the same pattern mirrored in y, then rotated)
C0201
  rect 0.368x0.324 smd: 1(-0.275,0) 2(0.275,0)
CAP-SMD_BD3.0-L3.3-W3.3-RD
  rect 2x0.8 smd: 1(1.37,0) 2(-1.37,0)
COMM-SMD_16P-L22.5-W18.0-P2.54-TL
  rect 2.102x1.802 smd: 1(-8.001,8.89) 2(-8.001,6.35) 3(-8.001,3.81) 4(-8.001,1.27) 5(-8.001,-1.27) 6(-8.001,-3.81) 7(-8.001,-6.35) 8(-8.001,-8.89) 9(8.001,-8.89) 10(8.001,-6.35) 11(8.001,-3.81) 12(8.001,-1.27) 13(8.001,1.27) 14(8.001,3.81) 15(8.001,6.35) 16(8.001,8.89)
CONN-SMD_532610271
  rect 0.8x1.6 smd: 1(0.625,-1.45) 2(-0.625,-1.45)
  rect 2.1x3 smd: 3(3.175,1.45) 4(-3.175,1.45)
ESOP-8_L4.9-W3.9-P1.27-LS6.0-BL-EP-1
  oval 0.63x1.865 smd: 1(-1.905,-2.683) 2(-0.635,-2.683) 3(0.635,-2.683) 4(1.905,-2.683) 5(1.905,2.683) 6(0.635,2.683) 7(-0.635,2.683) 8(-1.905,2.683)
  rect 3.3x2.4 smd: 9(0,0)
L0402
  rect 0.79x0.54 smd: 1(-0.545,0) 2(0.545,0)
OESIP-14_L5.6-W3.3-P0.80-TL
  rect 0.75x0.35 smd: 1(-1.2,2.4) 2(-1.2,1.6) 3(-1.2,0.8) 4(-1.2,0) 5(-1.2,-0.8) 6(-1.2,-1.6) 7(-1.2,-2.4) 8(1.2,-2.4) 9(1.2,-1.6) 10(1.2,-0.8) 11(1.2,0) 12(1.2,0.8) 13(1.2,1.6) 14(1.2,2.4)
QFN-24_L4.0-W4.0-P0.50-BL-EP2.7
  oval 0.28x0.8 smd: 1(-1.25,-2) 2(-0.75,-2) 3(-0.25,-2) 4(0.25,-2) 5(0.75,-2) 6(1.25,-2) 13(1.25,2) 14(0.75,2) 15(0.25,2) 16(-0.25,2) 17(-0.75,2) 18(-1.242,2)
  oval 0.8x0.28 smd: 7(2,-1.25) 8(2,-0.75) 9(2,-0.25) 10(2,0.25) 11(2,0.75) 12(2,1.25) 19(-2,1.25) 20(-2,0.75) 21(-2,0.25) 22(-2,-0.25) 23(-2,-0.75) 24(-2,-1.25)
  rect 2.7x2.7 smd: 25(0.013,0)
R0603
  rect 0.806x0.864 smd: 1(-0.753,0) 2(0.753,0)
SOT-89-3_L4.5-W2.5-P1.50-LS4.2-BR
  rect 1.575x0.672 smd: 1(1.356,-1.5) 3(1.356,1.5)
  custom 5.377x1.9 smd: 2(-1.356,0)
TO-39-4_MELEXIS_MLX90614XXA
  round 1.2 hole 0.8: 1(0,2.54) 2(-2.54,0) 3(0,-2.54) 4(2.54,0)

## Nets
As in the schematic.

Pads without a net: U16 1 4 5 6 7 8 9 10 11 12 13; U21 2 3 4 5 6 7 12 14 15 16 17 19 21 22; U22 1 5 6 7 8 13 14; U23 2 3 4

## Via types
v1: diameter 0.61, hole 0.305, Top Layer to Bottom Layer, 451 vias

## Routing (per net, layer and track width the routed paths; a pad name or vN(x,y) marks a point on that pad's centre or on a via; arc(x,y) is an arc through that point)
1.8V: length 30
  Top Layer w0.254: C69.1 30.22,8.26 C70.1 ; 37.14,14.87 37.92,14.09 38.01,14.09 38.17,13.92 38.17,13.03 38.01,12.87 36.45,12.87 36.06,12.47 36.05,12.47 36.02,12.44 36.02,12.44 35.99,12.42 35.98,12.42 35.96,12.39 35.94,12.39 35.92,12.37 35.91,12.37 35.89,12.35 35.87,12.35 35.85,12.33 35.83,12.33 35.81,12.31 35.79,12.31 35.77,12.3 35.74,12.3 35.73,12.28 35.7,12.28 35.69,12.27 35.66,12.27 35.65,12.26 35.61,12.26 35.61,12.26 35.57,12.26 35.57,12.25 35.53,12.25 35.52,12.25 34.51,12.25 34.39,12.12 34.39,8.31 ; 37.11,15.01 38.89,15.01 38.99,15.11
  Bottom Layer w0.254: 39.01,15.07 48.67,15.07 48.84,14.91 48.84,14.74 49.15,14.42
  vias: v1(39.08,15.16)
3V3: length 106.2
  Top Layer w0.254: 45.42,13.34 45.42,15.71 39.08,22.06 ; 8.23,34.89 11.84,34.89 11.93,34.79 14.26,34.79 16.67,32.39 26.98,32.39 27,32.38 27.96,32.38 28.9,33.32 ; 39,22.04 39,25.07 39.18,25.25 44.11,25.25 48.56,29.7 48.56,30.89 49.08,31.4 50.27,31.4 51.87,33 ; 34.19,22.19 34.42,21.96 34.42,13.53 ; 8.25,34.86 6.65,33.26 6.65,29.82 6.83,29.64 7.99,29.64 R65.2
  Bottom Layer w0.254: 48.32,14.39 47.61,14.39 ; 47.61,14.39 47.61,13.35 47.49,13.23 45.43,13.23 ; 47.61,14.39 47.61,14.43 ; 25.75,32.41 25.75,30.73 ; 25.72,30.7 34.41,22.01 47.22,22.01 ; 47.59,14.4 47.57,14.42 ; 48.07,24.8 47.72,24.44 45.46,24.44 43.98,22.96 43.98,22.1
  vias: v1(25.71,32.41) v1(34.09,22.33) v1(39.04,22.03) v1(45.42,13.27)
5V: length 42.4
  Top Layer w0.254: 19.45,33.06 23.55,33.06 28.88,38.38 ; 17.89,4.87 17.91,4.85 20.05,4.85
  Bottom Layer w0.254: 17.95,4.87 19.42,6.33 19.42,32.9
  vias: v1(17.91,4.87) v1(19.47,32.97)
GND: length 94.7
  Top Layer w0.254: 49.47,30.6 48.92,30.06 48.92,29.55 48.63,29.26 v1(48.63,23.46) ; 34.39,5.6 37.1,8.31 ; 29.17,36.06 32.85,36.06 33.87,35.05 ; 4.92,13.08 4.92,12.32 ; 4.92,12.32 4.92,12.22 4.84,12.14 ; 4.92,12.32 7.63,12.32 8.65,13.34 ; R66.1 22.79,5.5 U23.9 ; U23.9 27.96,5.49 C70.2 34.29,5.47 ; U23.9 20.87,3.59 U23.8 14.04,3.59 C68.2 9.48,4.12 U26.2 7.46,5.88 4.69,5.88 ; 37.1,8.39 40.72,8.39 40.85,8.26 ; 37.1,8.39 37.1,12.05 ; 37.1,8.39 37.01,8.39 ; 4.69,5.88 U26.4 ; 4.69,5.88 4.69,9.66 ; 4.75,9.99 4.75,12.14
  Bottom Layer w0.254: 50.42,23.92 50.51,24.01 50.51,24.78 ; 49.15,12.05 49.53,12.42 49.53,12.51 49.69,12.67 49.77,12.67 49.96,12.86 49.96,14.25 49.94,19.9 50.13,20.09 50.22,20.09 50.46,20.34 50.46,20.43 50.58,20.55 ; 48.26,23.52 48.25,23.5 47.31,23.5 ; 47.29,22.5 48.15,22.5 48.26,22.39 ; 50.09,21.72 50.56,21.25 50.56,20.89 ; 44.94,22.48 47.24,22.48 ; 47.29,22.53 47.27,22.52 ; 50.51,24.79 54.1,24.79 55.07,23.82 55.07,23.22 54.82,22.97 54.6,22.97
  vias: v1(2.42,39.75) v1(2.42,38.48) v1(2.42,37.21) v1(2.42,35.94) v1(2.42,34.67) v1(2.42,33.4) v1(2.42,32.13) v1(2.42,30.86) v1(2.42,29.59) v1(2.42,28.32) v1(2.42,27.05) v1(2.42,25.78) v1(2.42,24.51) v1(2.42,23.24) v1(2.42,21.97) v1(2.42,20.7) v1(2.42,19.43) v1(2.42,18.16) v1(2.42,16.89) v1(2.42,15.62) v1(2.42,14.35) v1(2.42,13.08) v1(3.69,39.75) v1(3.69,38.48) v1(3.69,37.21) v1(3.69,35.94) v1(3.69,34.67) v1(3.69,33.4) v1(3.69,32.13) v1(3.69,30.86) v1(3.69,29.59) v1(3.69,28.32) v1(3.69,27.05) v1(3.69,25.78) v1(3.69,24.51) v1(3.69,23.24) v1(3.69,21.97) v1(3.69,20.7) v1(3.69,19.43) v1(3.69,18.16) v1(3.69,16.89) v1(3.69,15.62) v1(3.69,14.35) v1(3.69,13.08) v1(4.96,39.75) v1(4.96,38.48) v1(4.96,37.21) v1(4.96,35.94) v1(4.96,34.67) v1(4.96,33.4) v1(4.96,32.13) v1(4.96,30.86) v1(4.96,29.59) v1(4.96,28.32) v1(4.96,27.05) v1(4.96,25.78) v1(4.96,24.51) v1(4.96,23.24) v1(4.96,21.97) v1(4.96,20.7) v1(4.96,19.43) v1(4.96,18.16) v1(4.96,16.89) v1(4.96,15.62) v1(4.96,14.35) v1(4.96,13.08) v1(5.85,27.13) v1(5.85,25.86) v1(5.85,24.59) v1(5.85,23.32) v1(5.85,22.05) v1(5.85,20.78) v1(5.85,19.51) v1(5.85,18.24) v1(5.85,16.97) v1(7.12,27.13) v1(7.12,25.86) v1(7.12,24.59) v1(7.12,23.32) v1(7.12,22.05) v1(7.12,20.78) v1(7.12,19.51) v1(7.12,18.24) v1(7.12,16.97) v1(8.39,27.13) v1(8.39,25.86) v1(8.39,24.59) v1(8.39,23.32) v1(8.39,22.05) v1(8.39,20.78) v1(8.39,19.51) v1(8.39,18.24) v1(8.39,16.97) v1(8.7,14.63) v1(8.7,13.36) v1(9.66,27.13) v1(9.66,25.86) v1(9.66,24.59) v1(9.66,23.32) v1(9.66,22.05) v1(9.66,20.78) v1(9.66,19.51) v1(9.66,18.24) v1(9.66,16.97) v1(9.97,14.63) v1(9.97,13.36) v1(11.24,14.63) v1(11.24,13.36) v1(12.51,14.63) v1(12.51,13.36) v1(13.78,14.63) v1(13.78,13.36) v1(15.05,14.63) v1(15.05,13.36) v1(16.32,14.63) v1(16.32,13.36) v1(16.79,27.34) v1(16.79,26.07) v1(16.79,24.8) v1(16.79,23.53) v1(16.79,22.26) v1(16.79,20.99) v1(16.79,19.72) v1(16.79,18.45) v1(16.79,17.18) v1(17.59,14.63) v1(17.59,13.36) v1(18.06,27.34) v1(18.06,26.07) v1(18.06,24.8) v1(18.06,23.53) v1(18.06,22.26) v1(18.06,20.99) v1(18.06,19.72) v1(18.06,18.45) v1(18.06,17.18) v1(20.13,14.63) v1(20.13,13.36) v1(20.6,27.34) v1(20.6,26.07) v1(20.6,24.8) v1(20.6,23.53) v1(20.6,22.26) v1(20.6,20.99) v1(20.6,19.72) v1(20.6,18.45) v1(20.6,17.18) v1(21.4,14.63) v1(21.4,13.36) v1(21.87,27.34) v1(21.87,26.07) v1(21.87,24.8) v1(21.87,23.53) v1(21.87,22.26) v1(21.87,20.99) v1(21.87,19.72) v1(21.87,18.45) v1(21.87,17.18) v1(22.67,14.63) v1(22.67,13.36) v1(23.14,27.34) v1(23.14,26.07) v1(23.14,24.8) v1(23.14,23.53) v1(23.14,22.26) v1(23.14,20.99) v1(23.14,19.72) v1(23.14,18.45) v1(23.14,17.18) v1(23.94,14.63) v1(23.94,13.36) v1(24.41,27.34) v1(24.41,26.07) v1(24.41,24.8) v1(24.41,23.53) v1(24.41,22.26) v1(24.41,20.99) v1(24.41,19.72) v1(24.41,18.45) v1(24.41,17.18) v1(25.21,14.63) v1(25.21,13.36) v1(26.48,14.63) v1(26.48,13.36) v1(27.75,14.63) v1(27.75,13.36) v1(29.02,14.63) v1(29.02,13.36) v1(30.29,14.63) v1(30.29,13.36) v1(33.92,38.83) v1(33.92,37.56) v1(33.92,35.02) v1(33.92,32.48) v1(33.92,31.21) v1(33.92,29.94) v1(33.92,28.67) v1(33.92,27.4) v1(35.19,38.83) v1(35.19,37.56) v1(35.19,35.02) v1(35.19,32.48) v1(35.19,31.21) v1(35.19,29.94) v1(35.19,28.67) v1(35.19,27.4) v1(36.46,38.83) v1(36.46,37.56) v1(36.46,35.02) v1(36.46,32.48) v1(36.46,31.21) v1(36.46,29.94) v1(36.46,28.67) v1(36.46,27.4) v1(37.73,38.83) v1(37.73,37.56) v1(37.73,35.02) v1(37.73,32.48) v1(37.73,31.21) v1(37.73,29.94) v1(37.73,28.67) v1(37.73,27.4) v1(39,38.83) v1(39,37.56) v1(39,35.02) v1(39,32.48) v1(39,31.21) v1(39,29.94) v1(39,28.67) v1(39,27.4) v1(39.37,9.39) v1(39.37,8.12) v1(39.37,6.85) v1(39.37,5.58) v1(39.37,4.31) v1(39.37,3.04) v1(40.27,38.83) v1(40.27,37.56) v1(40.27,35.02) v1(40.27,32.48) v1(40.27,31.21) v1(40.27,29.94) v1(40.27,28.67) v1(40.27,27.4) v1(40.64,9.39) v1(40.64,8.12) v1(40.64,6.85) v1(40.64,5.58) v1(40.64,4.31) v1(40.64,3.04) v1(41.54,38.83) v1(41.54,37.56) v1(41.54,35.02) v1(41.54,32.48) v1(41.54,31.21) v1(41.54,29.94) v1(41.54,28.67) v1(41.54,27.4) v1(41.91,9.39) v1(41.91,8.12) v1(41.91,6.85) v1(41.91,5.58) v1(41.91,4.31) v1(41.91,3.04) v1(43.18,9.39) v1(43.18,8.12) v1(43.18,6.85) v1(43.18,5.58) v1(43.18,4.31) v1(43.18,3.04) v1(44.45,9.39) v1(44.45,8.12) v1(44.45,6.85) v1(44.45,5.58) v1(44.45,4.31) v1(44.45,3.04) v1(45.72,9.39) v1(45.72,8.12) v1(45.72,6.85) v1(45.72,5.58) v1(45.72,4.31) v1(45.72,3.04) v1(46.99,9.39) v1(46.99,8.12) v1(46.99,6.85) v1(46.99,5.58) v1(46.99,4.31) v1(46.99,3.04) v1(47.55,18.96) v1(47.55,17.69) v1(47.55,16.42) v1(48.26,9.39) v1(48.26,8.12) v1(48.26,6.85) v1(48.26,5.58) v1(48.26,4.31) v1(48.26,3.04) v1(48.7,22.14) v1(48.82,18.96) v1(48.82,17.69) v1(48.82,16.42) v1(49.53,9.39) v1(49.53,8.12) v1(49.53,6.85) v1(49.53,5.58) v1(49.53,4.31) v1(49.53,3.04) v1(49.83,23.4) v1(49.9,22.13) v1(50.09,18.96) v1(50.09,17.69) v1(50.09,16.42) v1(50.09,15.15) v1(50.8,9.39) v1(50.8,8.12) v1(50.8,6.85) v1(50.8,5.58) v1(50.8,4.31) v1(50.8,3.04) v1(52.07,9.39) v1(52.07,8.12) v1(52.07,6.85) v1(52.07,5.58) v1(52.07,4.31) v1(52.07,3.04) v1(53.34,9.39) v1(53.34,8.12) v1(53.34,6.85) v1(53.34,5.58) v1(53.34,4.31) v1(53.34,3.04) v1(54.61,9.39) v1(54.61,8.12) v1(54.61,6.85) v1(54.61,5.58) v1(54.61,4.31) v1(54.61,3.04) v1(55.88,9.39) v1(55.88,8.12) v1(55.88,6.85) v1(55.88,5.58) v1(55.88,4.31) v1(55.88,3.04) v1(56.08,38.43) v1(56.08,37.16) v1(56.08,35.89) v1(56.08,32.08) v1(56.08,30.81) v1(56.08,29.54) v1(56.08,28.27) v1(56.08,27) v1(56.08,25.73) v1(56.08,24.46) v1(56.08,19.38) v1(56.08,18.11) v1(56.08,16.84) v1(56.08,15.57) v1(56.08,14.3) v1(56.08,13.03) v1(56.08,11.76) v1(56.08,10.49) v1(57.15,9.39) v1(57.15,8.12) v1(57.15,6.85) v1(57.15,5.58) v1(57.15,4.31) v1(57.15,3.04) v1(57.35,38.43) v1(57.35,37.16) v1(57.35,35.89) v1(57.35,34.62) v1(57.35,30.81) v1(57.35,29.54) v1(57.35,28.27) v1(57.35,27) v1(57.35,25.73) v1(57.35,24.46) v1(57.35,23.19) v1(57.35,21.92) v1(57.35,19.38) v1(57.35,18.11) v1(57.35,16.84) v1(57.35,15.57) v1(57.35,14.3) v1(57.35,13.03) v1(57.35,11.76) v1(57.35,10.49) v1(58.42,9.39) v1(58.42,8.12) v1(58.42,6.85) v1(58.42,5.58) v1(58.42,4.31) v1(58.42,3.04) v1(58.62,38.43) v1(58.62,37.16) v1(58.62,35.89) v1(58.62,34.62) v1(58.62,33.35) v1(58.62,29.54) v1(58.62,28.27) v1(58.62,27) v1(58.62,25.73) v1(58.62,24.46) v1(58.62,23.19) v1(58.62,21.92) v1(58.62,19.38) v1(58.62,18.11) v1(58.62,16.84) v1(58.62,15.57) v1(58.62,14.3) v1(58.62,13.03) v1(58.62,11.76) v1(58.62,10.49) v1(59.69,9.39) v1(59.69,8.12) v1(59.69,6.85) v1(59.69,5.58) v1(59.69,4.31) v1(59.69,3.04) v1(59.89,38.43) v1(59.89,37.16) v1(59.89,35.89) v1(59.89,34.62) v1(59.89,33.35) v1(59.89,32.08) v1(59.89,28.27) v1(59.89,27) v1(59.89,25.73) v1(59.89,24.46) v1(59.89,23.19) v1(59.89,21.92) v1(59.89,19.38) v1(59.89,18.11) v1(59.89,16.84) v1(59.89,15.57) v1(59.89,14.3) v1(59.89,13.03) v1(59.89,11.76) v1(59.89,10.49)
$1N754: length 77.3
  Top Layer w0.254: 46.83,33.2 46.44,33.59 34.15,33.59 30.26,29.71 18.84,29.71 14.96,33.59 13.23,33.59 ; 53.74,18.69 53.19,19.25 53.19,22 ; 8.49,31.58 10.32,33.41 12.95,33.41
  Bottom Layer w0.254: 51.33,22.02 56.56,22.02 56.72,22.17 56.72,22.43 55.42,23.72 55.42,23.97 54.25,25.14 54,25.14 51.96,27.18 46.8,27.18 46.62,27.36 46.62,27.62 46.75,27.74 46.75,33 ; 50.79,12.03 51.13,12.37 51.13,12.51 51.29,12.67 51.43,12.67 53.81,15.06 53.81,18.62
  vias: v1(53.26,22.03) v1(53.78,18.64)
$1N755: length 86.1
  Top Layer w0.254: 49.48,35.68 49.27,35.89 34.07,35.89 30.26,39.69 27.93,39.69 24.12,35.89 13,35.89 ; 8.49,36.44 12.46,36.44 12.95,35.94
  Bottom Layer w0.254: 52.34,20.38 52.34,14.39 52.04,14.09 52.04,13.93 51.87,13.76 51.58,13.76 50.33,12.51 50.33,12.38 49.97,12.02 ; 52.34,20.38 52.38,20.34 60.32,20.34 60.5,20.52 60.5,29.44 54.33,35.61 49.67,35.61 49.55,35.73 ; 52.34,20.38 52.34,20.4 ; 51.28,21.44 52.33,20.39
$1N7337: length 17.6
  Top Layer w0.254: 20.1,6.13 19.59,6.64 18.08,6.64 17.9,6.81 17.9,9.54 L2.1 16.46,9.81 C68.1 13.11,7.26 U26.1
$1N11704: length 6.2
  Top Layer w0.254: R66.2 23.58,10.39 22.27,10.39 21.02,9.14 21.02,8.32 U23.5
$1N11786: length 13.9
  Top Layer w0.254: 27.06,3.6 27.01,3.55 25.48,3.55 ; 19.34,9.8 20.76,11.22
  Bottom Layer w0.254: 20.67,11.19 27.06,4.8 27.06,3.57
  vias: v1(20.72,11.22) v1(27.06,3.58)
$1N12199: length 2.3
  Bottom Layer w0.254: 44.85,23.06 47.16,23.06
$1N12305: length 3.4
  Bottom Layer w0.254: 51.21,23.53 51.22,23.54 54.63,23.54

## Copper pours and planes (outline as drawn; the poured copper is in the pictures)
GND on Top Layer: 32.69,31.37 44.2,31.37 44.2,26.91 32.69,26.91
GND on Top Layer: 1.05,40.31 5.45,40.31 5.45,11.7 1.05,11.7
GND on Top Layer: 7.33,16.22 31.23,16.22 31.23,11.99 7.33,11.99
GND on Top Layer: 46.18,25.24 51.35,25.24 51.35,9.97 46.18,9.97
GND on Top Layer: 4.48,27.73 10.51,27.73 10.51,15.6 4.48,15.6
GND on Top Layer: 38,10.19 60.97,10.19 60.97,1.67 38,1.67
GND on Top Layer: 15.42,28.45 26.03,28.45 26.03,15.8 15.42,15.8
GND on Top Layer: 54.71,40.01 60.88,40.01 60.88,9.12 54.71,9.12
GND on Bottom Layer: 1.2,40.33 16.88,40.33 16.88,1.3 1.2,1.3
GND on Bottom Layer: 42.28,39.64 60.88,39.64 60.88,36.47 42.28,36.47
GND on Bottom Layer: 28.54,20.39 38.44,20.39 38.44,9.15 28.54,9.15
GND on Bottom Layer: 28.41,10.06 60.94,10.06 60.94,1.72 28.41,1.72
GND on Bottom Layer: 14.76,40.11 33.26,40.11 33.26,33.53 14.76,33.53
GND on Bottom Layer: 20.67,24.58 29.53,24.58 29.53,12.66 20.67,12.66
GND on Bottom Layer: 32.55,39.61 42.85,39.61 42.85,26.03 32.55,26.03

## Text on the board
Top Silkscreen Layer: 팜 덥니?
